# EAGLE design LowVBoard_02 (EAGLE 9.2.2)
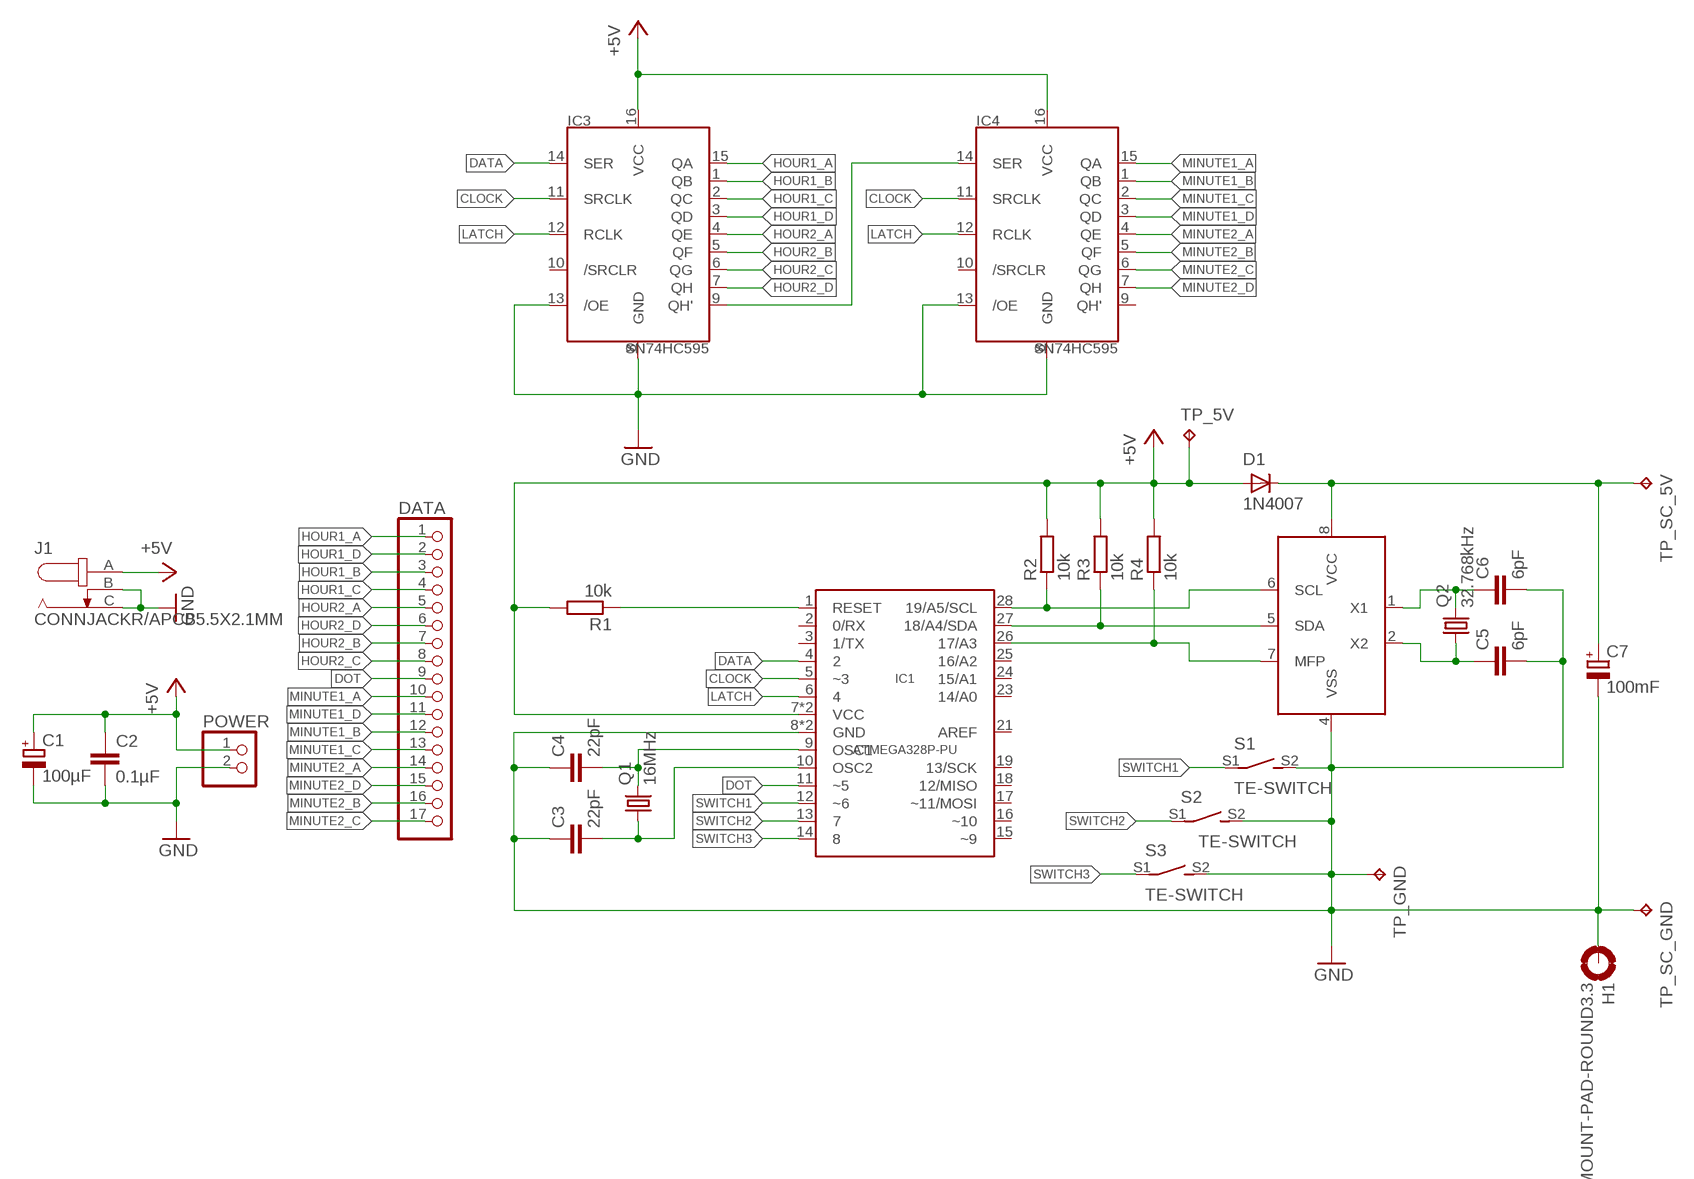
[diagram p0: schematic, sheet 1]

## Parts
C1  100µF  CPOL-EUE2-5  [E2-5]
C2  0.1µF  C-EU025-024X044  [C025-024X044]
C3  22pF  C-EU025-024X044  [C025-024X044]
C4  22pF  C-EU025-024X044  [C025-024X044]
C5  6pF  C-EU025-024X044  [C025-024X044]
C6  6pF  C-EU025-024X044  [C025-024X044]
C7  100mF  FTW0H104ZF  [SUPERCAP-11.5]
D1  1N4007  [DO41-7.6]
DATA  PINHD-1X17  [1X17]
H1  MOUNT-PAD-ROUND3.3  [3,3-PAD]
IC1  ATMEGA328P-PU  [DIP28]
IC2  MCP7940M  MCP7940M-I/P  [DIL8]
IC3  SN74HC595  [DIL16]
IC4  SN74HC595  [DIL16]
J1  CONNJACKR/APCB5.5X2.1MM  [CONNJACKR/APCB5.5X2.1MM]
POWER  PINHD-1X2  [1X02]
Q1  16MHz  CRYSTALHC49S  [HC49/S]
Q2  32.768kHz  CFS-206  [CFS-206]
R1  10k  R-EU_0207/7  [0207/7]
R2  10k  R-EU_0207/7  [0207/7]
R3  10k  R-EU_0207/7  [0207/7]
R4  10k  R-EU_0207/7  [0207/7]
S1  TE-SWITCH  [TE-SWITCH]
S2  TE-SWITCH  [TE-SWITCH]
S3  TE-SWITCH  [TE-SWITCH]
TP_5V  TPPAD1-13  [P1-13]
TP_GND  TPPAD1-13  [P1-13]
TP_SC_5V  TPPAD1-13  [P1-13]
TP_SC_GND  TPPAD1-13  [P1-13]

## Nets
+5V [+5V]: C1.+ C2.1 D1.A IC1.7(VCC) IC1.20(VCC) IC3.16(VCC) IC4.16(VCC) J1.A POWER.1 R1.2 R2.2 R3.2 R4.2 TP_5V.TP
CLOCK: IC1.5(~3) IC3.11(SRCLK) IC4.11(SRCLK)
DATA: IC1.4 IC3.14(SER)
DOT: DATA.9 IC1.11(~5)
GND [GND]: C1.- C2.2 C3.1 C4.1 C5.2 C6.2 C7.- H1.B3,3(MOUNT) IC1.8(GND) IC1.22(GND) IC2.4(VSS) IC3.8(GND) IC3.13(/OE) IC4.8(GND) IC4.13(/OE) J1.B J1.C POWER.2 S1.S2(S) S2.S2(S) S3.S2(S) TP_GND.TP TP_SC_GND.TP
HOUR1_A: DATA.1 IC3.15(QA)
HOUR1_B: DATA.3 IC3.1(QB)
HOUR1_C: DATA.4 IC3.2(QC)
HOUR1_D: DATA.2 IC3.3(QD)
HOUR2_A: DATA.5 IC3.4(QE)
HOUR2_B: DATA.7 IC3.5(QF)
HOUR2_C: DATA.8 IC3.6(QG)
HOUR2_D: DATA.6 IC3.7(QH)
LATCH: IC1.6 IC3.12(RCLK) IC4.12(RCLK)
MINUTE1_A: DATA.10 IC4.15(QA)
MINUTE1_B: DATA.12 IC4.1(QB)
MINUTE1_C: DATA.13 IC4.2(QC)
MINUTE1_D: DATA.11 IC4.3(QD)
MINUTE2_A: DATA.14 IC4.4(QE)
MINUTE2_B: DATA.16 IC4.5(QF)
MINUTE2_C: DATA.17 IC4.6(QG)
MINUTE2_D: DATA.15 IC4.7(QH)
N$1: C7.+ D1.C IC2.8(VCC) TP_SC_5V.TP
N$53: C4.2 IC1.9(OSC1) Q1.2
N$54: C3.2 IC1.10(OSC2) Q1.1
N$56: IC1.1(RESET) R1.1
N$57: IC1.28(19/A5/SCL) IC2.6(SCL) R2.1
N$58: IC1.27(18/A4/SDA) IC2.5(SDA) R3.1
N$59: IC1.26(17/A3) IC2.7(MFP) R4.1
N$60: C6.1 IC2.1(X1) Q2.P$2
N$61: C5.1 IC2.2(X2) Q2.P$1
N$69: IC3.9(QH') IC4.14(SER)
SWITCH1: IC1.12(~6) S1.S1(P)
SWITCH2: IC1.13 S2.S1(P)
SWITCH3: IC1.14 S3.S1(P)
Unconnected: IC1.2(0/RX) IC1.3(1/TX) IC1.15(~9) IC1.16(~10) IC1.17(~11/MOSI) IC1.18(12/MISO) IC1.19(13/SCK) IC1.21(AREF) IC1.23(14/A0) IC1.24(15/A1) IC1.25(16/A2) IC3.10(/SRCLR) IC4.9(QH') IC4.10(/SRCLR)

## Library data of the parts
C1 = resistor:CPOL-EU: POLARIZED CAPACITOR, European symbol
C2-C6 = resistor:C-EU: CAPACITOR, European symbol
C7 = Nixie:FTW0H104ZF
D1 = Nixie:1N4007
DATA = pinhead:PINHD-1X17: PIN HEADER
H1 = holes:MOUNT-PAD-ROUND: MOUNTING PAD, round
IC1 = Programmer:ATMEGA328P-PU
IC2 = Nixie:MCP7940M-I/P
IC3 IC4 = Nixie:SN74HC595
J1 = Nixie:CONNJACKR/APCB5.5X2.1MM
POWER = pinhead:PINHD-1X2: PIN HEADER
Q1 = crystal:CRYSTAL: CRYSTAL; OC_FARNELL: 1667008; OC_NEWARK: unknown
Q2 = Nixie:CFS-206
R1-R4 = resistor:R-EU_: RESISTOR, European symbol
S1-S3 = Nixie:TE-SWITCH
TP_5V TP_GND TP_SC_5V TP_SC_GND = testpad:TP: Test pad

## Net classes
0 SIGNAL: width 0.203 mm, clearance 0.203 mm
1 +5V: width 0.406 mm, clearance 0.203 mm
2 GND: clearance 0.203 mm

## Board
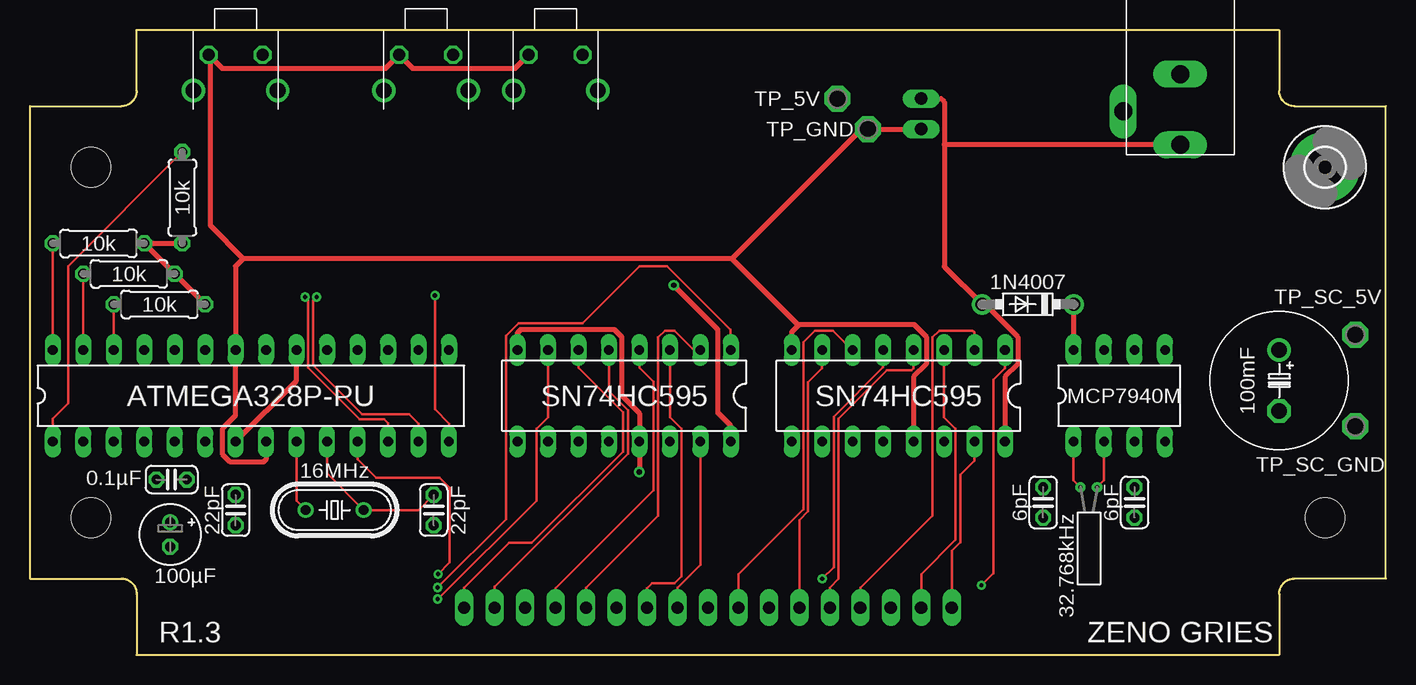
[diagram p1: board, top side]
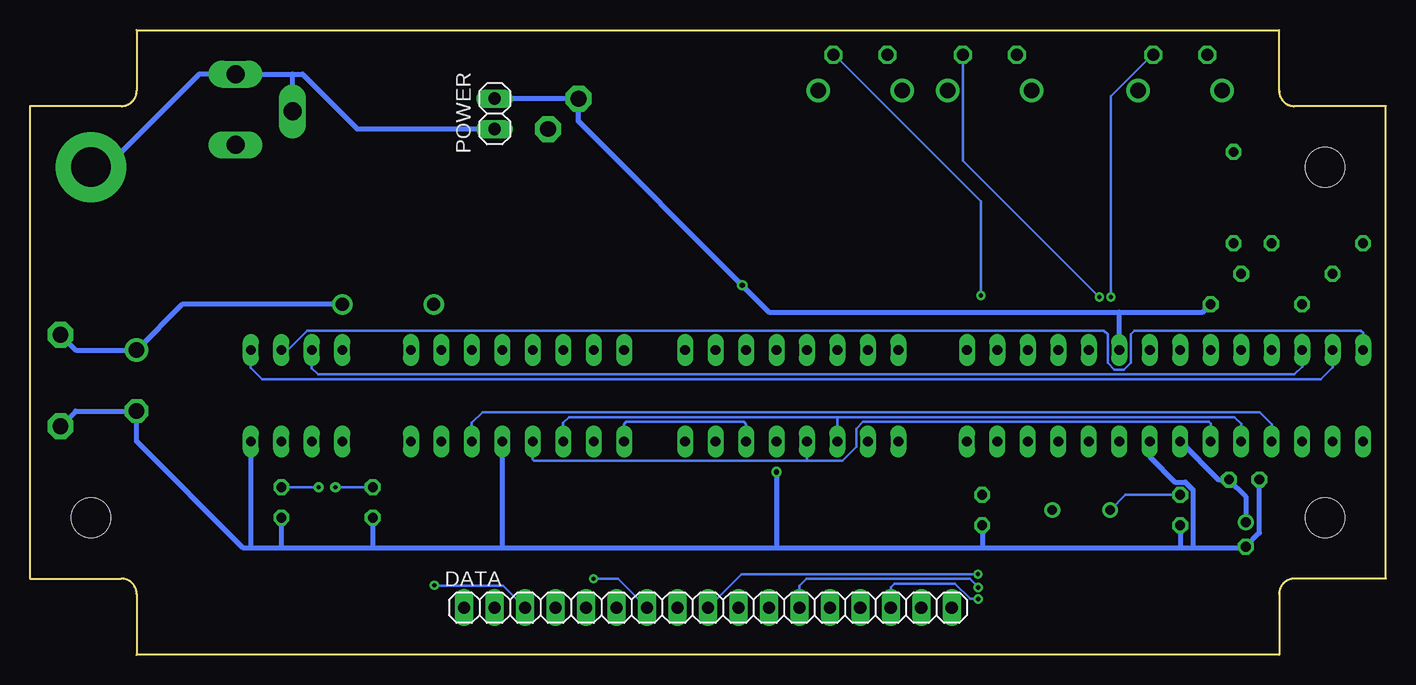
[diagram p2: board, bottom side, seen from below]

Size 113.03 x 52.07 mm. Coordinates in mm from the lower left corner, seen from the top.
Outline: 0,6.35 0,45.72 7.62,45.72 arc90 8.89,46.99 8.89,52.07 104.14,52.07 104.14,46.99 arc90 105.41,45.72 113.03,45.72 113.03,6.35 105.41,6.35 arc90 104.14,5.08 104.14,0 8.89,0 8.89,5.08 arc90 7.62,6.35 0,6.35
Copper layers (1*16): Top 0.035mm / dielectric 1.5mm / Bottom 0.035mm
Design rules "default": minimum track width 6mil, minimum drill 0.35mm, track to track 6mil, track to pad 6mil, pad to pad 6mil, via to via 6mil, smd to smd 6mil, copper to edge 40mil, drill to drill 6mil, minimum pad ring 10mil, minimum via ring 8mil, stop-mask expansion 4mil, vias tented up to drill 0mil, thermal gap 10mil
Holes 3.3 mm at 5.08,40.64 5.08,11.43 107.95,11.43

### Footprints (pad centres in the part's own frame; a part is rotated, then mirrored left to right if it is on the bottom)
E2-5 = drill 0.813 pad 1.27: + -1.016,0 | drill 0.813 pad 1.27 octagon: - 1.016,0
C025-024X044 = drill 0.813 octagon: 1 -1.27,0; 2 1.27,0
SUPERCAP-11.5 = drill 1.3: + -2.54,0 | drill 1.3 octagon: - 2.54,0
DO41-7.6 = drill 1.1 pad 1.7: A 3.81,0; C -3.81,0
1X17 = drill 1.016 long: 1 -20.32,0; 2 -17.78,0; 3 -15.24,0; 4 -12.7,0; 5 -10.16,0; 6 -7.62,0; 7 -5.08,0; 8 -2.54,0; 9 0,0; 10 2.54,0; 11 5.08,0; 12 7.62,0; 13 10.16,0; 14 12.7,0; 15 15.24,0; 16 17.78,0; 17 20.32,0
3,3-PAD = drill 3.3 pad 5.842: B3,3 0,0
DIP28 = drill 0.813 long: 1 -16.51,-3.81; 2 -13.97,-3.81; 3 -11.43,-3.81; 4 -8.89,-3.81; 5 -6.35,-3.81; 6 -3.81,-3.81; 7 -1.27,-3.81; 8 1.27,-3.81; 9 3.81,-3.81; 10 6.35,-3.81; 11 8.89,-3.81; 12 11.43,-3.81; 13 13.97,-3.81; 14 16.51,-3.81; 15 16.51,3.81; 16 13.97,3.81; 17 11.43,3.81; 18 8.89,3.81; 19 6.35,3.81; 20 3.81,3.81; 21 1.27,3.81; 22 -1.27,3.81; 23 -3.81,3.81; 24 -6.35,3.81; 25 -8.89,3.81; 26 -11.43,3.81; 27 -13.97,3.81; 28 -16.51,3.81
DIL8 = drill 0.813 long: 1 -3.81,-3.81; 2 -1.27,-3.81; 3 1.27,-3.81; 4 3.81,-3.81; 5 3.81,3.81; 6 1.27,3.81; 7 -1.27,3.81; 8 -3.81,3.81
DIL16 = drill 0.813 long: 1 -8.89,-3.81; 2 -6.35,-3.81; 3 -3.81,-3.81; 4 -1.27,-3.81; 5 1.27,-3.81; 6 3.81,-3.81; 7 6.35,-3.81; 8 8.89,-3.81; 9 8.89,3.81; 10 6.35,3.81; 11 3.81,3.81; 12 1.27,3.81; 13 -1.27,3.81; 14 -3.81,3.81; 15 -6.35,3.81; 16 -8.89,3.81
CONNJACKR/APCB5.5X2.1MM = drill 1.5 long: A 0,6.4; B 0,0.5; C 4.75,3.6
1X02 = drill 1.016 long: 1 -1.27,0; 2 1.27,0
HC49/S = drill 0.813: 1 -2.413,0; 2 2.413,0
CFS-206 = drill 0.35: P$1 0,-0.7; P$2 0,0.7
0207/7 = drill 0.813 octagon: 1 -3.81,0; 2 3.81,0
TE-SWITCH = drill 1.3: A1 -3.505,1.49; A2 3.505,1.49 | drill 0.99 octagon: S1 -2.25,-1.49; S2 2.25,-1.49
P1-13 = drill 1.321 pad 2.159 octagon: TP 0,0

### Placement (x,y rotation side)
C1  11.68,10.03 270 top
C2  11.81,14.61 180 top
C3  33.66,12.06 90 top
C4  17.14,12.06 90 top
C5  92.08,12.7 270 top
C6  84.45,12.7 270 top
C7  104.14,22.86 270 top
D1  83.19,29.21 180 top
DATA  56.52,3.94 0 bottom
H1  107.95,40.64 0 top
IC1  18.41,21.59 0 top
IC2  90.81,21.59 0 top
IC3  72.39,21.59 180 top
IC4  49.53,21.59 180 top
J1  95.89,48.9 180 top
POWER  74.3,45.09 270 bottom
Q1  25.4,12.06 180 top
Q2  88.27,13.97 90 top
R1  12.7,38.1 270 top
R2  5.71,34.29 0 top
R3  8.26,31.75 0 top
R4  10.79,29.21 0 top
S1  17.14,48.51 180 top
S2  33.02,48.51 180 top
S3  43.81,48.51 180 top
TP_5V  67.31,46.35 0 top
TP_GND  69.85,43.81 0 top
TP_SC_5V  110.49,26.67 0 top
TP_SC_GND  110.49,19.05 0 top

### Tracks (layer width: path | path; a pad name or v marks a point on that pad's centre or on a via)
+5V  (via drill 0.45)
  Top 0.406: POWER.1 75.95,46.35 76.22,46.08 76.22,42.55 | 76.22,42.55 76.22,32.36 D1.A 79.64,29.21 82.35,26.5 82.35,24.22 81.28,23.16 IC3.16 | IC1.7 22.23,22.86 IC1.20 | R4.2 R3.2 R2.2 R1.2 | IC4.16 58.42,19.09 57.35,20.15 57.35,27.1 v53.66,30.8 | J1.A 76.28,42.49 76.22,42.55
  Bottom 0.406: POWER.1 TP_5V.TP 67.31,44.45 v53.66,30.8 51.41,28.55 22.23,28.55 | 22.23,28.55 15.27,28.55 R4.2 | IC1.20 22.23,28.55 | IC1.7 13.97,14.61 C2.1 11.68,13.21 C1.+
CLOCK
  Bottom 0.203: 45.72,19.81 IC4.11 | IC1.5 12.06,19.25 12.63,19.81 45.72,19.81 | 45.72,19.81 68.1,19.81 68.58,19.33 IC3.11
DATA
  Bottom 0.203: IC1.4 9.53,19.23 10.52,20.22 75.31,20.22 76.2,19.33 IC3.14
DOT  (via drill 0.35)
  Top 0.203: IC1.11 27.3,16.31 28.85,14.76 34.13,14.76 34.98,13.91 34.98,7.7 v34.01,6.73
  Bottom 0.203: DATA.9 53.72,6.73 34.29,6.73 | 34.29,6.73 | 34.29,6.73 v34.01,6.73
GND  (via drill 0.45)
  Top 0.406: v50.8,15.24 IC4.13 50.8,20.14 49.33,21.61 49.33,26.5 48.7,27.13 40.94,27.13 40.64,26.83 IC4.8 | 64.07,27.47 64.13,27.53 73.69,27.53 74.73,26.5 74.73,24.22 73.66,23.16 IC3.13 | 64.07,27.47 63.5,26.91 IC3.8 | 58.52,33.02 69.32,43.81 TP_GND.TP POWER.2 | 64.07,27.47 58.52,33.02 | IC1.8 19.68,16.3 19.44,16.05 16.7,16.05 16.08,16.68 16.08,18.88 17.14,19.95 IC1.22 17.14,32.38 17.78,33.02 | 58.52,33.02 17.78,33.02 | S3.S2 40.41,48.85 31.93,48.85 S2.S2 29.61,48.85 16.05,48.85 S1.S2 15.02,49.88 15.02,35.78 17.78,33.02
  Bottom 0.406: 16.08,8.89 17.14,8.89 | 17.14,8.89 33.66,8.89 | 33.66,8.89 50.8,8.89 | 50.8,8.89 73.66,8.89 | 73.66,8.89 84.45,8.89 | 84.45,8.89 92.08,8.89 | 92.08,8.89 94.61,8.89 | C5.2 92.08,8.89 | C6.2 84.45,8.89 | C3.1 33.66,8.89 | C4.1 17.14,8.89 | IC3.13 73.66,8.89 | v50.8,15.24 50.8,8.89 | IC1.8 19.68,16.51 17.58,14.4 16.7,14.4 16.08,13.78 16.08,8.89 | IC2.4 94.61,8.89 | 16.08,8.89 11.81,8.89 C1.- 10.54,10.16 C2.2 | 94.61,8.89 95.25,8.89 104.14,17.78 C7.- 109.22,20.32 TP_SC_GND.TP | POWER.2 85.72,43.81 90.31,48.4 91.14,48.4 | H1.B3,3 106.68,40.64 98.92,48.4 J1.B 91.14,48.4 | J1.C 91.14,48.4 | 91.14,48.4
HOUR1_A
  Top 0.203: DATA.1 76.83,8.65 77.57,9.39 77.57,15.01 78.74,16.18 IC3.15
HOUR1_B  (via drill 0.35)
  Top 0.203: v79.32,5.79 80.31,6.78 80.31,22.91 81.28,23.88 IC3.1
  Bottom 0.203: DATA.3 73.58,5.77 79.3,5.77 v79.32,5.79
HOUR1_C
  Top 0.203: DATA.4 69.22,5.59 75.23,11.61 75.23,26.46 75.8,27.03 78.58,27.03 78.74,26.87 IC3.2
HOUR1_D
  Top 0.203: IC3.3 76.2,19.8 77.17,18.84 77.17,9.58 74.3,6.71 DATA.2
HOUR2_A
  Top 0.203: DATA.5 66.67,5.59 67.41,6.33 67.41,19.67 71.44,23.7 73.48,23.7 73.66,23.88 IC3.4
HOUR2_B  (via drill 0.35)
  Top 0.203: v66.04,6.35 67,7.32 67,19.84 71.12,23.95 IC3.5
  Bottom 0.203: DATA.7 64.01,6.35 v66.04,6.35
HOUR2_C
  Top 0.203: DATA.8 59.05,6.73 64.47,12.14 64.47,26.04 65.46,27.03 66.95,27.03 IC3.6
HOUR2_D
  Top 0.203: IC3.7 66.04,23.87 64.87,22.7 64.87,11.97 64.14,11.24 DATA.6
LATCH
  Bottom 0.203: IC1.6 14.61,19.27 14.74,19.41 43.58,19.41 44.15,18.84 44.15,17.33 45.32,16.15 48.26,16.15 | IC4.12 48.26,16.15 | 48.26,16.15 70.99,16.15 71.12,16.28 IC3.12
MINUTE1_A
  Top 0.203: DATA.10 53.98,5.59 55.88,7.49 IC4.15
MINUTE1_B  (via drill 0.35)
  Top 0.203: IC4.1 58.4,25.43 58.4,27.1 53.11,32.38 50.8,32.38 46.05,27.64 40.72,27.64 39.67,26.59 39.67,11.3 v33.98,5.61
  Bottom 0.203: DATA.12 48.9,5.74 48.31,6.33 34.7,6.33 v33.98,5.61
MINUTE1_C
  Top 0.203: IC4.2 55.37,25.4 53.74,27.03 52.94,27.03 52.38,26.46 52.38,11.61 46.35,5.59 DATA.13
MINUTE1_D
  Top 0.203: DATA.11 51.44,5.56 51.84,5.97 53.72,5.97 54.3,6.55 54.3,18.84 53.34,19.8 IC4.3
MINUTE2_A
  Top 0.203: DATA.14 43.81,5.56 51.97,13.72 51.97,22.76 50.8,23.93 IC4.4
MINUTE2_B
  Top 0.203: DATA.16 38.73,5.66 49.84,16.75 49.84,20.39 48.26,21.96 IC4.5
MINUTE2_C
  Top 0.203: IC4.6 45.72,23.93 49.43,20.22 49.43,16.92 41.83,9.32 39.94,9.32 36.2,5.57 DATA.17
MINUTE2_D  (via drill 0.35)
  Top 0.203: IC4.7 43.18,19.8 42.22,18.84 42.22,12.85 34.02,4.65 v33.98,4.65
  Bottom 0.203: DATA.15 41.27,5.61 40.97,5.92 35.91,5.92 34.64,4.65 v33.98,4.65
N$1
  Top 0.406: D1.C IC2.8
  Bottom 0.406: D1.C 100.33,29.21 C7.+ 109.22,25.4 TP_SC_5V.TP
N$53
  Top 0.203: IC1.9 22.23,12.83 Q1.2
  Bottom 0.203: C4.2 21.72,13.34 Q1.2
N$54
  Top 0.203: IC1.10 24.77,15.11 Q1.1 32.38,12.06 C3.2
N$56
  Top 0.203: R1.1 3.17,32.38 3.17,20.95 1.91,19.68 IC1.1
N$57
  Top 0.203: R2.1 IC1.28
  Bottom 0.203: IC1.28 1.91,26.84 2.09,27.03 20.96,27.03 21.26,26.73 21.26,24.34 21.82,23.77 22.62,23.77 23.19,24.34 23.19,26.73 23.49,27.03 89.94,27.03 91.56,25.4 IC2.6
N$58
  Top 0.203: R3.1 IC1.27
  Bottom 0.203: IC1.27 4.45,23.96 5.44,22.96 93.67,22.96 94.61,23.91 IC2.5
N$59
  Top 0.203: R4.1 IC1.26
  Bottom 0.203: IC1.26 6.99,24 7.62,23.37 89,23.37 89.53,23.9 IC2.7
N$60
  Top 0.203: IC2.1 87,14.54 Q2.P$2
  Bottom 0.203: C6.1 Q2.P$2
N$61
  Top 0.203: IC2.2 89.53,14.54 Q2.P$1
  Bottom 0.203: Q2.P$1 C5.1
N$69
  Bottom 0.203: IC3.9 63.5,19.23 63.32,19.41 53.52,19.41 53.34,19.23 IC4.14
SWITCH1  (via drill 0.35)
  Top 0.203: IC1.12 29.84,19.3 29.52,19.63 27.48,19.63 23.19,23.92 23.19,29.57 v22.94,29.82
  Bottom 0.203: S1.S1 19.48,50.01 22.94,46.55 v22.94,29.82
SWITCH2  (via drill 0.35)
  Top 0.203: IC1.13 32.38,19.25 31.59,20.04 27.69,20.04 23.6,24.13 23.6,29.51 23.62,29.54 v23.9,29.82
  Bottom 0.203: v23.9,29.82 35.24,41.17 35.24,49.98 S2.S1
SWITCH3  (via drill 0.35)
  Top 0.203: IC1.14 34.92,19.27 33.75,20.45 v33.75,29.94 v33.76,29.95
  Bottom 0.203: S3.S1 45.95,50.01 33.76,37.81 v33.76,29.95

### Text on the board
tNames: R1.3 | ZENO GRIES